# EAGLE schematic PIC_backpack (EAGLE 8.2.1)
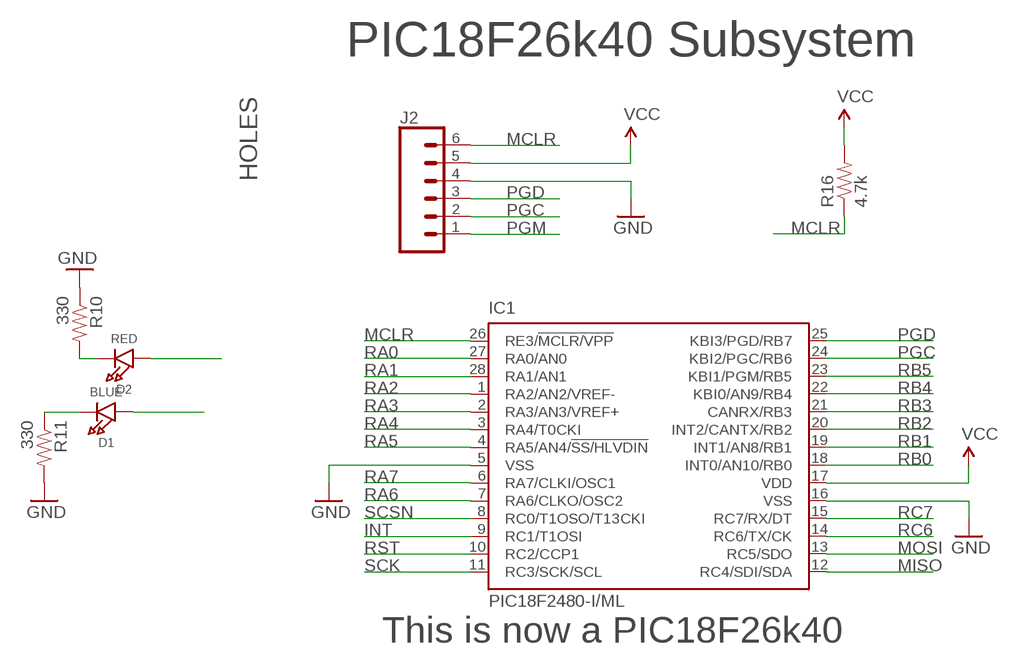
[diagram p0: schematic, sheet 1, part 1 of 2]
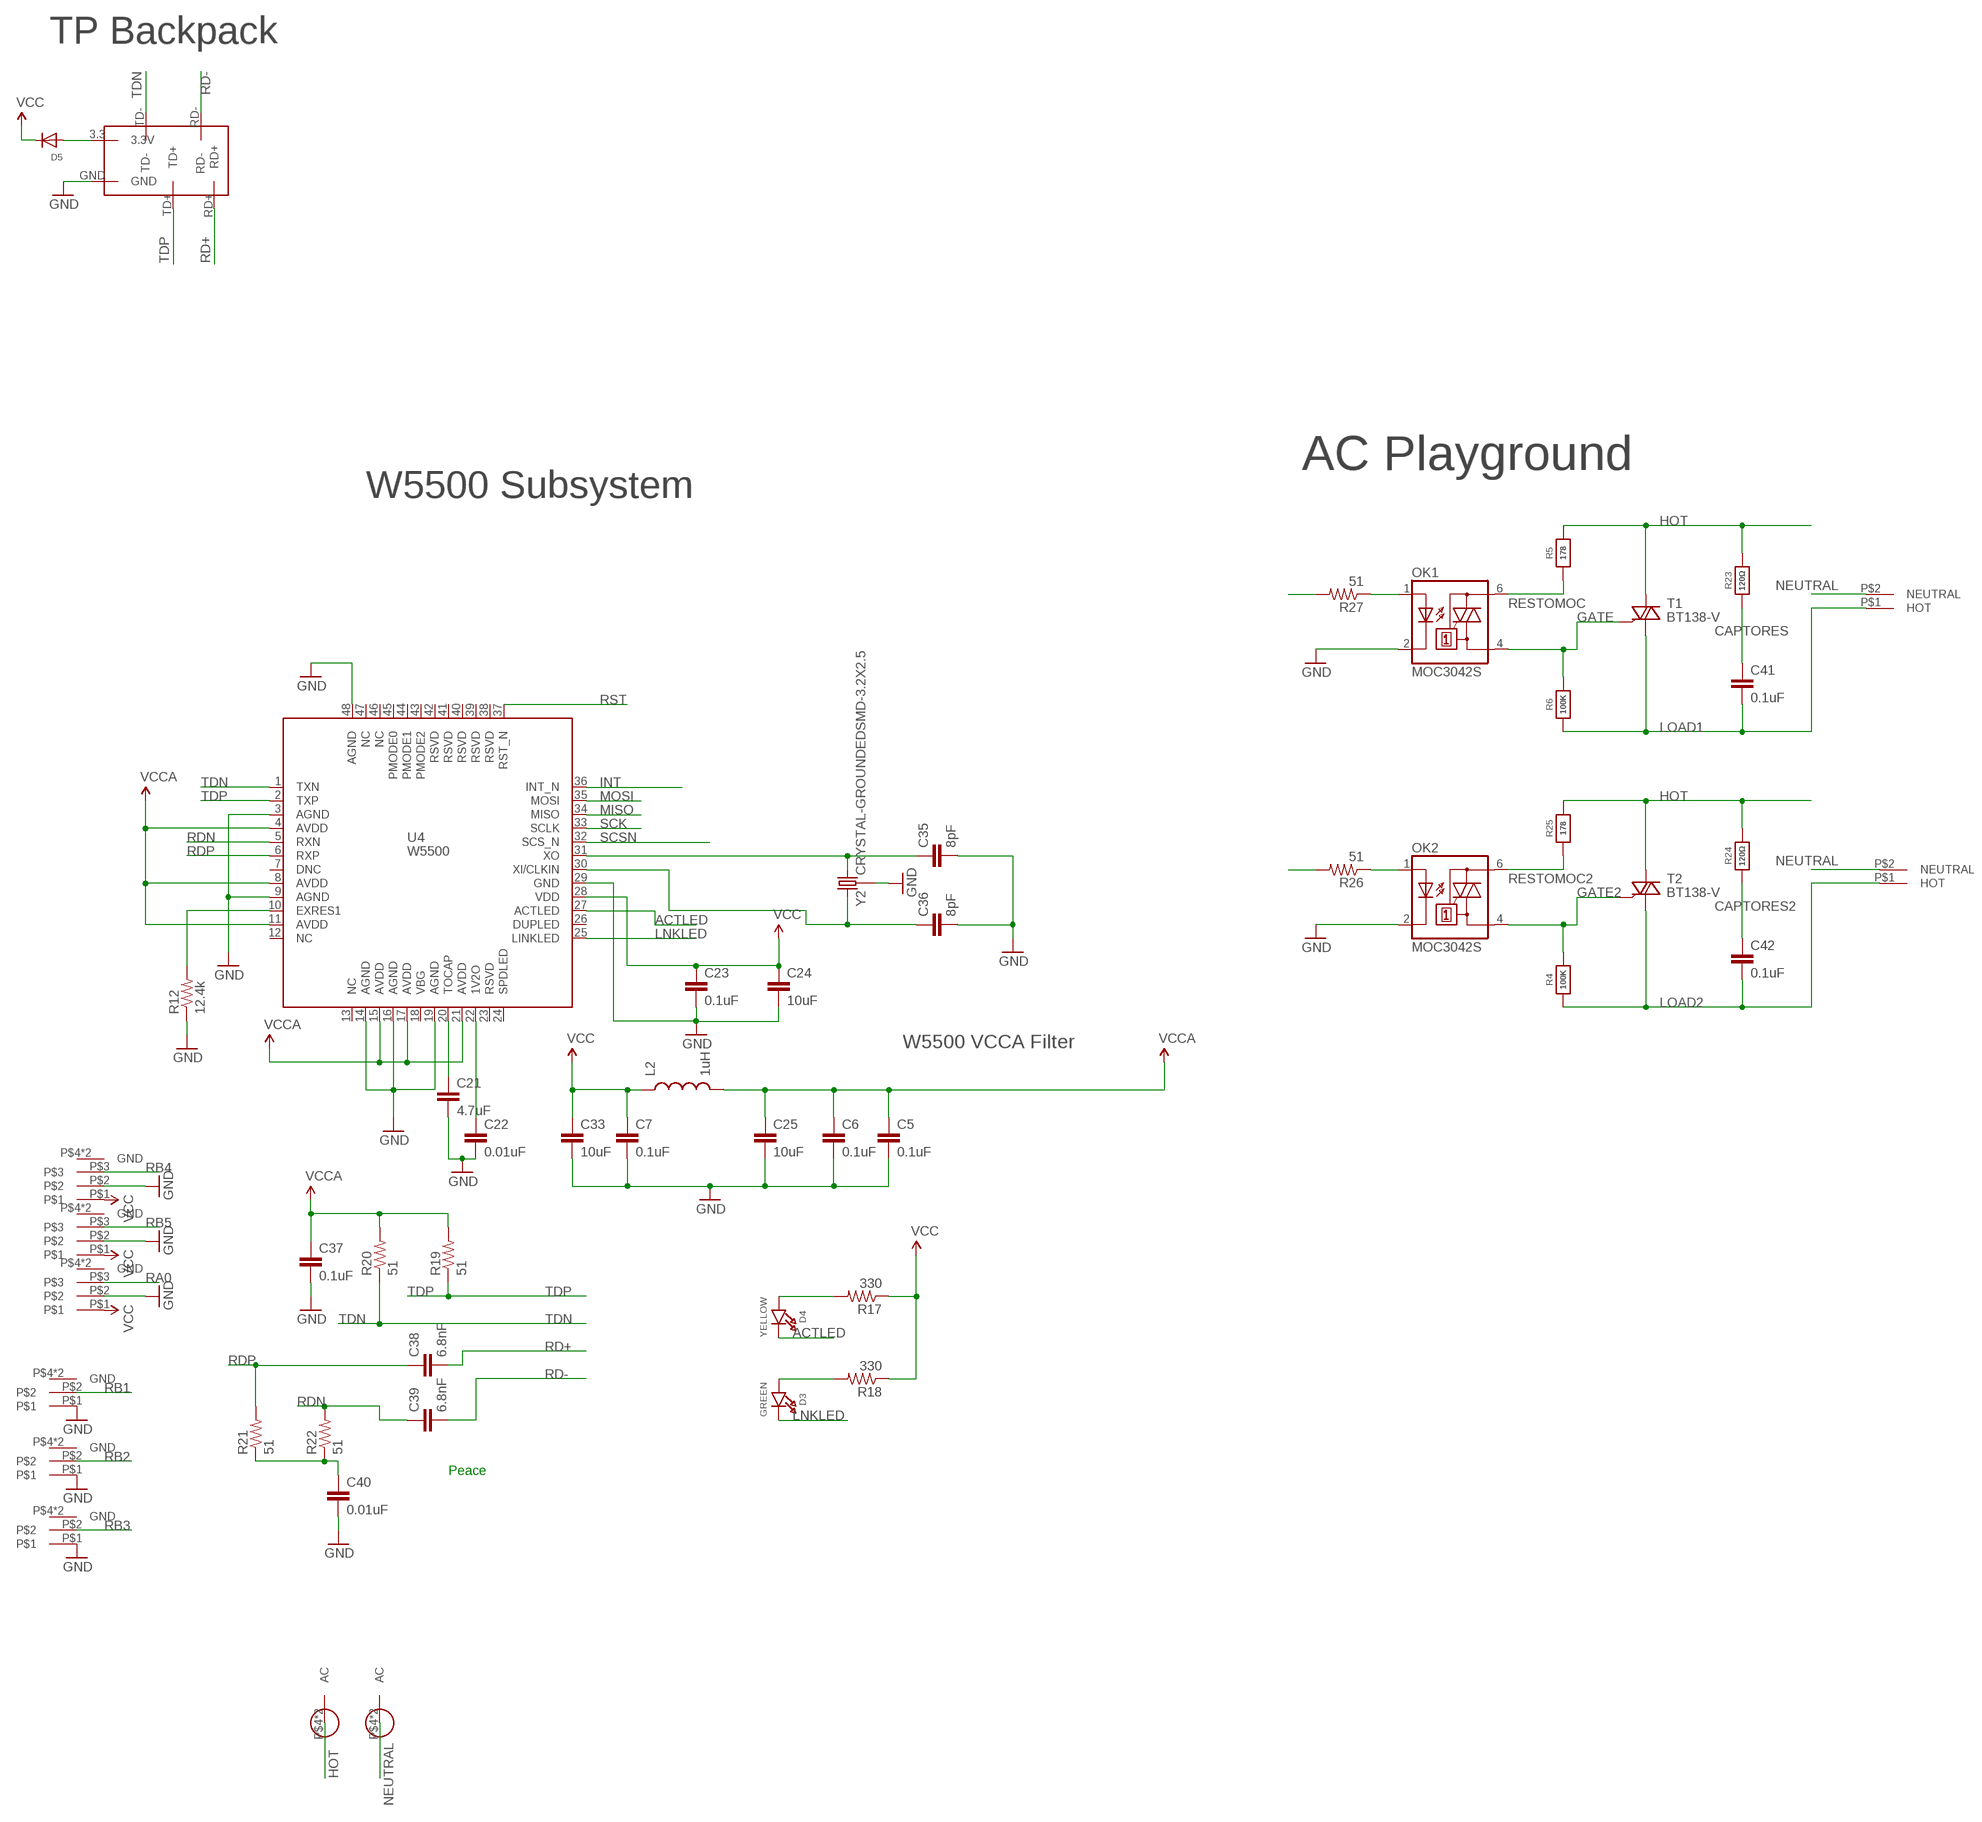
[diagram p1: schematic, sheet 1, part 2 of 2]

## Parts
C5  0.1uF  CAP0603-CAP  [0603-CAP]
C6  0.1uF  CAP0603-CAP  [0603-CAP]
C7  0.1uF  CAP0603-CAP  [0603-CAP]
C21  4.7uF  CAP0603-CAP  [0603-CAP]
C22  0.01uF  CAP0603-CAP  [0603-CAP]
C23  0.1uF  CAP0603-CAP  [0603-CAP]
C24  10uF  CAP0603-CAP  [0603-CAP]
C25  10uF  CAP0603-CAP  [0603-CAP]
C33  10uF  CAP0603-CAP  [0603-CAP]
C35  8pF  CAP0603-CAP  [0603-CAP]
C36  8pF  CAP0603-CAP  [0603-CAP]
C37  0.1uF  CAP0603-CAP  [0603-CAP]
C38  6.8nF  CAP0603-CAP  [0603-CAP]
C39  6.8nF  CAP0603-CAP  [0603-CAP]
C40  0.01uF  CAP0603-CAP  [0603-CAP]
C41  0.1uF  CAP1210  [1210]
C42  0.1uF  CAP1210  [1210]
D1  BLUE  LED0603_NOOUTLINE  [CHIPLED_0603_NOOUTLINE]
D2  RED  LED0603_NOOUTLINE  [CHIPLED_0603_NOOUTLINE]
D3  GREEN  LED0603_NOOUTLINE  [CHIPLED_0603_NOOUTLINE]
D4  YELLOW  LED0603_NOOUTLINE  [CHIPLED_0603_NOOUTLINE]
D5  DIODESOD-123  [SOD-123]
IC1  PIC18F2480-I/ML  [QFN28-ML_6X6MM]
J2  CONN_06NO_SILK_FEMALE_PTH  [1X06_NO_SILK]
L2  1uH  INDUCTOR0603  [0603]
OK1  MOC3042S  [DIL6-SMD]
OK2  MOC3042S  [DIL6-SMD]
R4  100K  RESISTOR0805_10MGAP  [0805_10MGAP]
R5  178  RESISTOR0805_10MGAP  [0805_10MGAP]
R6  100K  RESISTOR0805_10MGAP  [0805_10MGAP]
R10  330  RESISTOR0603-RES  [0603-RES]
R11  330  RESISTOR0603-RES  [0603-RES]
R12  12.4k  RESISTOR0603-RES  [0603-RES]
R16  4.7k  RESISTOR0603-RES  [0603-RES]
R17  330  RESISTOR0603-RES  [0603-RES]
R18  330  RESISTOR0603-RES  [0603-RES]
R19  51  RESISTOR0603-RES  [0603-RES]
R20  51  RESISTOR0603-RES  [0603-RES]
R21  51  RESISTOR0603-RES  [0603-RES]
R22  51  RESISTOR0603-RES  [0603-RES]
R23  120Ω  RESISTOR0805_10MGAP  [0805_10MGAP]
R24  120Ω  RESISTOR0805_10MGAP  [0805_10MGAP]
R25  178  RESISTOR0805_10MGAP  [0805_10MGAP]
R26  51  RESISTOR0603-RES  [0603-RES]
R27  51  RESISTOR0603-RES  [0603-RES]
T1  BT138-V  [TO220BV]
T2  BT138-V  [TO220BV]
U4  W5500  [W5500]
U$1  TPLINK_BACKPACK  [BACKPACK_WITH_PROTO]
U$2  AC_BLADE  [AC_BLADE]
U$3  AC_BLADE  [AC_BLADE]
U$4  AC_TERMINAL  [AC_TERMINAL]
U$5  AC_TERMINAL  [AC_TERMINAL]
U$11  JST_MINI_MICRO  [3P_JST1.0]
U$12  JST_MINI_MICRO  [3P_JST1.0]
U$13  JST_MINI_MICRO  [3P_JST1.0]
U$14  2P_JST_MINI_MICRO  [2P_JST1.0]
U$16  2P_JST_MINI_MICRO  [2P_JST1.0]
U$17  2P_JST_MINI_MICRO  [2P_JST1.0]
Y2  CRYSTAL-GROUNDEDSMD-3.2X2.5  [CRYSTAL-SMD-3.2X2.5MM]

## Nets
ACTLED: D4.C U4.27(ACTLED)
CAPTORES: C41.1 R23.1
CAPTORES2: C42.1 R24.1
GATE: OK1.4(A1) R6.2 T1.G
GATE2: OK2.4(A1) R4.2 T2.G
GND: C5.2 C6.2 C7.2 C21.2 C22.2 C23.2 C24.2 C25.2 C33.2 C35.2 C36.2 C37.2 C40.2 IC1.5(VSS) IC1.16(VSS) J2.4 OK1.2(C) OK2.2(C) R10.1 R11.2 R12.1 U4.3(AGND) U4.9(AGND) U4.14(AGND) U4.16(AGND) U4.19(AGND) U4.29(GND) U4.48(AGND) U$1.GND U$11.P$2 U$12.P$2 U$13.P$2 U$14.P$1 U$16.P$1 U$17.P$1 Y2.2 Y2.4
HOT: R5.2 R23.2 R24.2 R25.2 T1.T2(A2) T2.T2(A2) U$2.P$4(AC) U$2.P$5(AC)
INT: IC1.9(RC1/T1OSI) U4.36(INT_N)
LNKLED: D3.C U4.25(LINKLED)
LOAD1: C41.2 R6.1 T1.T1(A1) U$5.P$1(HOT)
LOAD2: C42.2 R4.1 T2.T1(A1) U$4.P$1(HOT)
MCLR: IC1.26(RE3/!MCLR/VPP) J2.6 R16.1
MISO: IC1.12(RC4/SDI/SDA) U4.34(MISO)
MOSI: IC1.13(RC5/SDO) U4.35(MOSI)
N$2: D2.C R10.2
N$3: C21.1 U4.20(TOCAP)
N$5: D1.C R11.1
N$8: C22.1 U4.22(1V2O)
N$10: R12.2 U4.10(EXRES1)
N$12: D4.A R17.2
N$13: D3.A R18.2
N$15: D5.A U$1.3.3(3.3V)
N$16: C40.1 R21.1 R22.1
N$23: C35.1 U4.31(XO) Y2.3
N$24: C36.1 U4.30(XI/CLKIN) Y2.1
N$26: OK1.1(A) R27.1
N$29: OK2.1(A) R26.1
NEUTRAL: U$3.P$4(AC) U$3.P$5(AC) U$4.P$2(NEUTRAL) U$5.P$2(NEUTRAL)
PGC: IC1.24(KBI2/PGC/RB6) J2.2
PGD: IC1.25(KBI3/PGD/RB7) J2.3
PGM: J2.1
RA0: IC1.27(RA0/AN0) U$13.P$3
RA1: IC1.28(RA1/AN1)
RA2: IC1.1(RA2/AN2/VREF-)
RA3: IC1.2(RA3/AN3/VREF+)
RA4: IC1.3(RA4/T0CKI) R26.2
RA5: IC1.4(RA5/AN4/!SS/HLVDIN) R27.2
RA6: IC1.7(RA6/CLKO/OSC2)
RA7: IC1.6(RA7/CLKI/OSC1)
RB0: IC1.18(INT0/AN10/RB0)
RB1: IC1.19(INT1/AN8/RB1) U$14.P$2
RB2: IC1.20(INT2/CANTX/RB2) U$16.P$2
RB3: IC1.21(CANRX/RB3) U$17.P$2
RB4: IC1.22(KBI0/AN9/RB4) U$11.P$3
RB5: IC1.23(KBI1/PGM/RB5) U$12.P$3
RC6: D2.A IC1.14(RC6/TX/CK)
RC7: D1.A IC1.15(RC7/RX/DT)
RD+: C38.2 U$1.RD+
RD-: C39.2 U$1.RD-
RDN: C39.1 R22.2 U4.5(RXN)
RDP: C38.1 R21.2 U4.6(RXP)
RESTOMOC: OK1.6(A2) R5.1
RESTOMOC2: OK2.6(A2) R25.1
RST: IC1.10(RC2/CCP1) U4.37(RST_N)
SCK: IC1.11(RC3/SCK/SCL) U4.33(SCLK)
SCSN: IC1.8(RC0/T1OSO/T13CKI) U4.32(SCS_N)
TDN: R20.1 U4.1(TXN) U$1.TD-
TDP: R19.1 U4.2(TXP) U$1.TD+
VCC: C7.1 C23.1 C24.1 C33.1 D5.C IC1.17(VDD) J2.5 L2.1 R16.2 R17.1 R18.1 U4.28(VDD) U$11.P$1 U$12.P$1 U$13.P$1
VCCA: C5.1 C6.1 C25.1 C37.1 L2.2 R19.2 R20.2 U4.4(AVDD) U4.8(AVDD) U4.11(AVDD) U4.15(AVDD) U4.17(AVDD) U4.21(AVDD)
Unconnected: U4.7(DNC) U4.12(NC) U4.13(NC) U4.18(VBG) U4.23(RSVD) U4.24(SPDLED) U4.26(DUPLED) U4.38(RSVD) U4.39(RSVD) U4.40(RSVD) U4.41(RSVD) U4.42(RSVD) U4.43(PMODE2) U4.44(PMODE1) U4.45(PMODE0) U4.46(NC) U4.47(NC) U$11.P$4(GND) U$11.P$5(GND) U$12.P$4(GND) U$12.P$5(GND) U$13.P$4(GND) U$13.P$5(GND) U$14.P$4(GND) U$14.P$5(GND) U$16.P$4(GND) U$16.P$5(GND) U$17.P$4(GND) U$17.P$5(GND)

## Notes on the sheet
- TP Backpack
- AC Playground
- W5500 Subsystem
- PIC18F26k40 Subsystem
- HOLES
- W5500 VCCA Filter
- This is now a PIC18F26k40
- Peace

## Library data of the parts
C5-C7 C21-C25 C33 C35-C40 = SparkFun-Passives:CAP: Capacitor Standard 0603 ceramic capacitor, and 0.1" leaded capacitor.
C41 C42 = SparkFun-Capacitors:CAP: Capacitor Standard 0603 ceramic capacitor, and 0.1" leaded capacitor.
D1-D4 = microbuilder:LED: LED 0603 - 0603 Surface Mount Package 2mA: Green LED - Low Power (3.9mcd, 2ma, 1.7Vf) - Digikey: 475-2709-2-ND Orange LED - Low Power (9.8mcd, 2ma, 1.8Vf) - Digikey: 475-1194-2-ND Red LED - Low Power (5mcd, 2ma, 1.8Vf) - Digikey: 475-1195-2-ND Yellow LED - Low Power (7mcd, 2ma, 1.8Vf) - Digikey: 475-1196-2-ND 5mA: Blue LED - Low Power (17mcd, 5ma, 2.9Vf) - Digikey: LNJ937W8CRACT-ND 0805 - 0805 Surface Mount Package 2mA: Red LED (8.8mcd, 2mA, 1.8Vf, Clear) - Low Power [Digikey: 475-2510-1-ND] Green LED (5mcd, 2mA, 1.8Vf, Clear) - Low Power [Digikey: 475-2730-1-ND] Yellow LED (11.3mcd, 2mA, 1.8Vf, Clear) - Low Power [Digikey: 475-2555-1-ND] 20mA: Red LED (104mcd, 20mA, Diffused) - LS R976 [Digikey: 475-1278-6-ND] Red LED (12mcd, 20mA, 2.0Vf, Clear) - APT2012EC [Digikey: 754-1128-1-ND] Green LED (15mcd, 20mA, 2.2Vf, Clear) - APT2012GC [Digikey: 754-1131-1-ND] Orange LED (160mcd, 20mA, 2.1Vf, Clear) - APT2012SECK [Digikey: 754-1130-1-ND] 1206 - 1206 Surface Mount Package Green LED (26mcd, 20mA, Diffused) - LG N971 [Digikey: 475-1407-6-ND] Red LED (15mcd, 20mA, Diffused) - LH N974 [Digikey: 475-1416-6-ND] Cree - Cree High-Power Surface Mount LEDs XPEBWT-L1-0000-00D50 - White 111lm 350mA 2.9Vf 6200K 110° XTEAWT-00-0000-00000LEE3 - White 114lm 350mA 2.85Vf 5000K 115° Everlight - Everlight 45-21 Series Surface Mount LEDs 45-21/QK2C-B2832AC2CB2/2T - Warm White 2000mcd 20mA 3.25Vf 3050K 120° 45-21/LK2C-B38452C4CB2/2T - Nuetral White 2000mcd 20mA 3.25Vf 4150K 120° 45-21/LK2C-B50634C6CB2/2T - Cold White 2200mcd 20mA 3.25Vf 5650K 120° PLCC2 Reverse Mount LS T77K-J1L2-1-0-2-R18-Z - Red 11.25mcd 2mA 1.8Vf 630nm 120° LO T77K-L1M2-24-Z - Orange 19.6mcd 2mA 1.8Vf 606nm 120° LY T77K-K2M1-26-Z - Yellow 15.7mcd 2mA 1.8Vf 587nm 120°
D5 = adafruit:DIODE: Diode SMADIODE - SMA Surface Mount Package 20V 1A Schottky Diode Digikey: 641-1014-6-ND DO-1N4148 - Through Hole Small Current Diode SOD-123 20V 1 A (.5mV Vf) Schottky Diode - Digikey: MBRX120TPMSCT-ND SOD-323 10V 570mA (.38mV Vf, 3ns) Schottky Diode - Digikey: ZLLS410CT-ND SOD-523 30V 30mA Schottky Diode (RB751S-40TE61) - Digikey: RB751S-40TE61CT-ND SOT23-R/W - SOT23 Package (R = Solder Paste/Reflow Ovens, W = Hand-Soldering) BAT54Film 40V 300mA - Digikey: 497-7162-1-ND
IC1 = microchip:PIC18F2*80: 28-Pin Enhanced Flash Microcontrollers with ECAN(TM) Technology 10-Bit A/D and nanoWatt Technology Source: http://www.microchip.com .. 39637a.pdf; MF: MICROCHIP; MPN: PIC18F2480-I/ML; OC_FARNELL: 1556179; OC_NEWARK: 71J7235
J2 = SparkFun-Connectors:CONN_06: Multi connection point. Often used as Generic Header-pin footprint for 0.1 inch spaced/style header connections On any of the 0.1 inch spaced packages, you can populate with these: Break Away Headers - Straight <https://www.sparkfun.com/products/116> (PRT-00116) Break Away Male Headers - Right Angle <https://www.sparkfun.com/products/553> (PRT-00553) Female Headers <https://www.sparkfun.com/products/115> (PRT-00115) Break Away Headers - Machine Pin <https://www.sparkfun.com/products/117> (PRT-00117) Break Away Female Headers - Swiss Machine Pin <https://www.sparkfun.com/products/743> (PRT-00743) Arduino Stackable Header - 6 Pin <https://www.sparkfun.com/products/9280> (PRT-09280) For SCREWTERMINALS and SPRING TERMINALS visit here: Screw Terimnals on SparkFun.com <https://www.sparkfun.com/search/results?term=Screw+Terminals> (5mm/3.5mm/2.54mm spacing) This device is also useful as a general connection point to wire up your design to another part of your project. Our various solder wires solder well into these plated through hole pads. Hook-Up Wire - Assortment (Stranded, 22 AWG) <https://www.sparkfun.com/products/11375> (PRT-11375) Hook-Up Wire - Assortment (Solid Core, 22 AWG) <https://www.sparkfun.com/products/11367> (PRT-11367) View the entire wire category on our website here <https://www.sparkfun.com/categories/141>; PROD_ID: CONN-08437
L2 = SparkFun-Passives:INDUCTOR: Inductors Basic Inductor/Choke - 0603 and 1206. Footprints are not proven and vary greatly between part numbers. INDUCTOR POWER 3.3UH 4.0A SMD 0.197" L x 0.197" W x 0.177" H (5.00mm x 5.00mm x 4.50mm)
OK1 OK2 = optocoupler:MOC30*: 6-Pin DIP Zero-Cross Optoisolators Triac Driver Output (250/400 Volt Peak) Source: Data sheet <http://www.fairchildsemi.com/ds/MO/MOC3031M.pdf> The old path of data sheet not more available 2013-05-06.; MF: FAIRCHILD SEMICONDUCTOR; MPN: MOC3042SM; OC_FARNELL: unknown; OC_NEWARK: 34C1339
R4-R6 R23-R25 = microbuilder:RESISTOR: Resistors For new designs, use the packages preceded by an '_' character since they are more reliable: The following footprints should be used on most boards: _0402 - Standard footprint for regular board layouts _0603 - Standard footprint for regular board layouts _0805 - Standard footprint for regular board layouts _1206 - Standard footprint for regular board layouts For extremely tight-pitch boards where space is at a premium, the following 'micro-pitch' footprints can be used (smaller pads, no silkscreen outline, etc.): _0402MP - Micro-pitch footprint for very dense/compact boards _0603MP - Micro-pitch footprint for very dense/compact boards _0805MP - Micro-pitch footprint for very dense/compact boards _1206MP - Micro-pitch footprint for very dense/compact boards
R10-R12 R16-R22 R26 R27 = SparkFun-Passives:RESISTOR: Resistor Basic schematic elements and footprints for 0603, 1206, and PTH resistors.
T1 T2 = triac:BT138: TRIAC Source: http://www.semiconductors.philips.com BT138_SERIES_2.pdf
U4 = W5500:W5500
U$1 = Heep:TPLINK_BACKPACK
U$2 U$3 = Heep:AC_BLADE
U$4 U$5 = Heep:AC_TERMINAL
U$11-U$13 = Heep:JST_MINI_MICRO
U$14 U$16 U$17 = Heep:2P_JST_MINI_MICRO
Y2 = SparkFun-Clocks:CRYSTAL-GROUNDED: Crystals w/ Ground Pin (Generic) These are passive quartz crystals, which can be used as a clock source for a microcontroller. Crystal's are usually two-terminal devices. A third terminal may be optionally connected to ground, as recommended by the manufaturer.